# Altium schematic sheet COMMUNICATION.SchDoc
size 420 x 297 mm; SheetNumber: 4; SheetTotal: 6
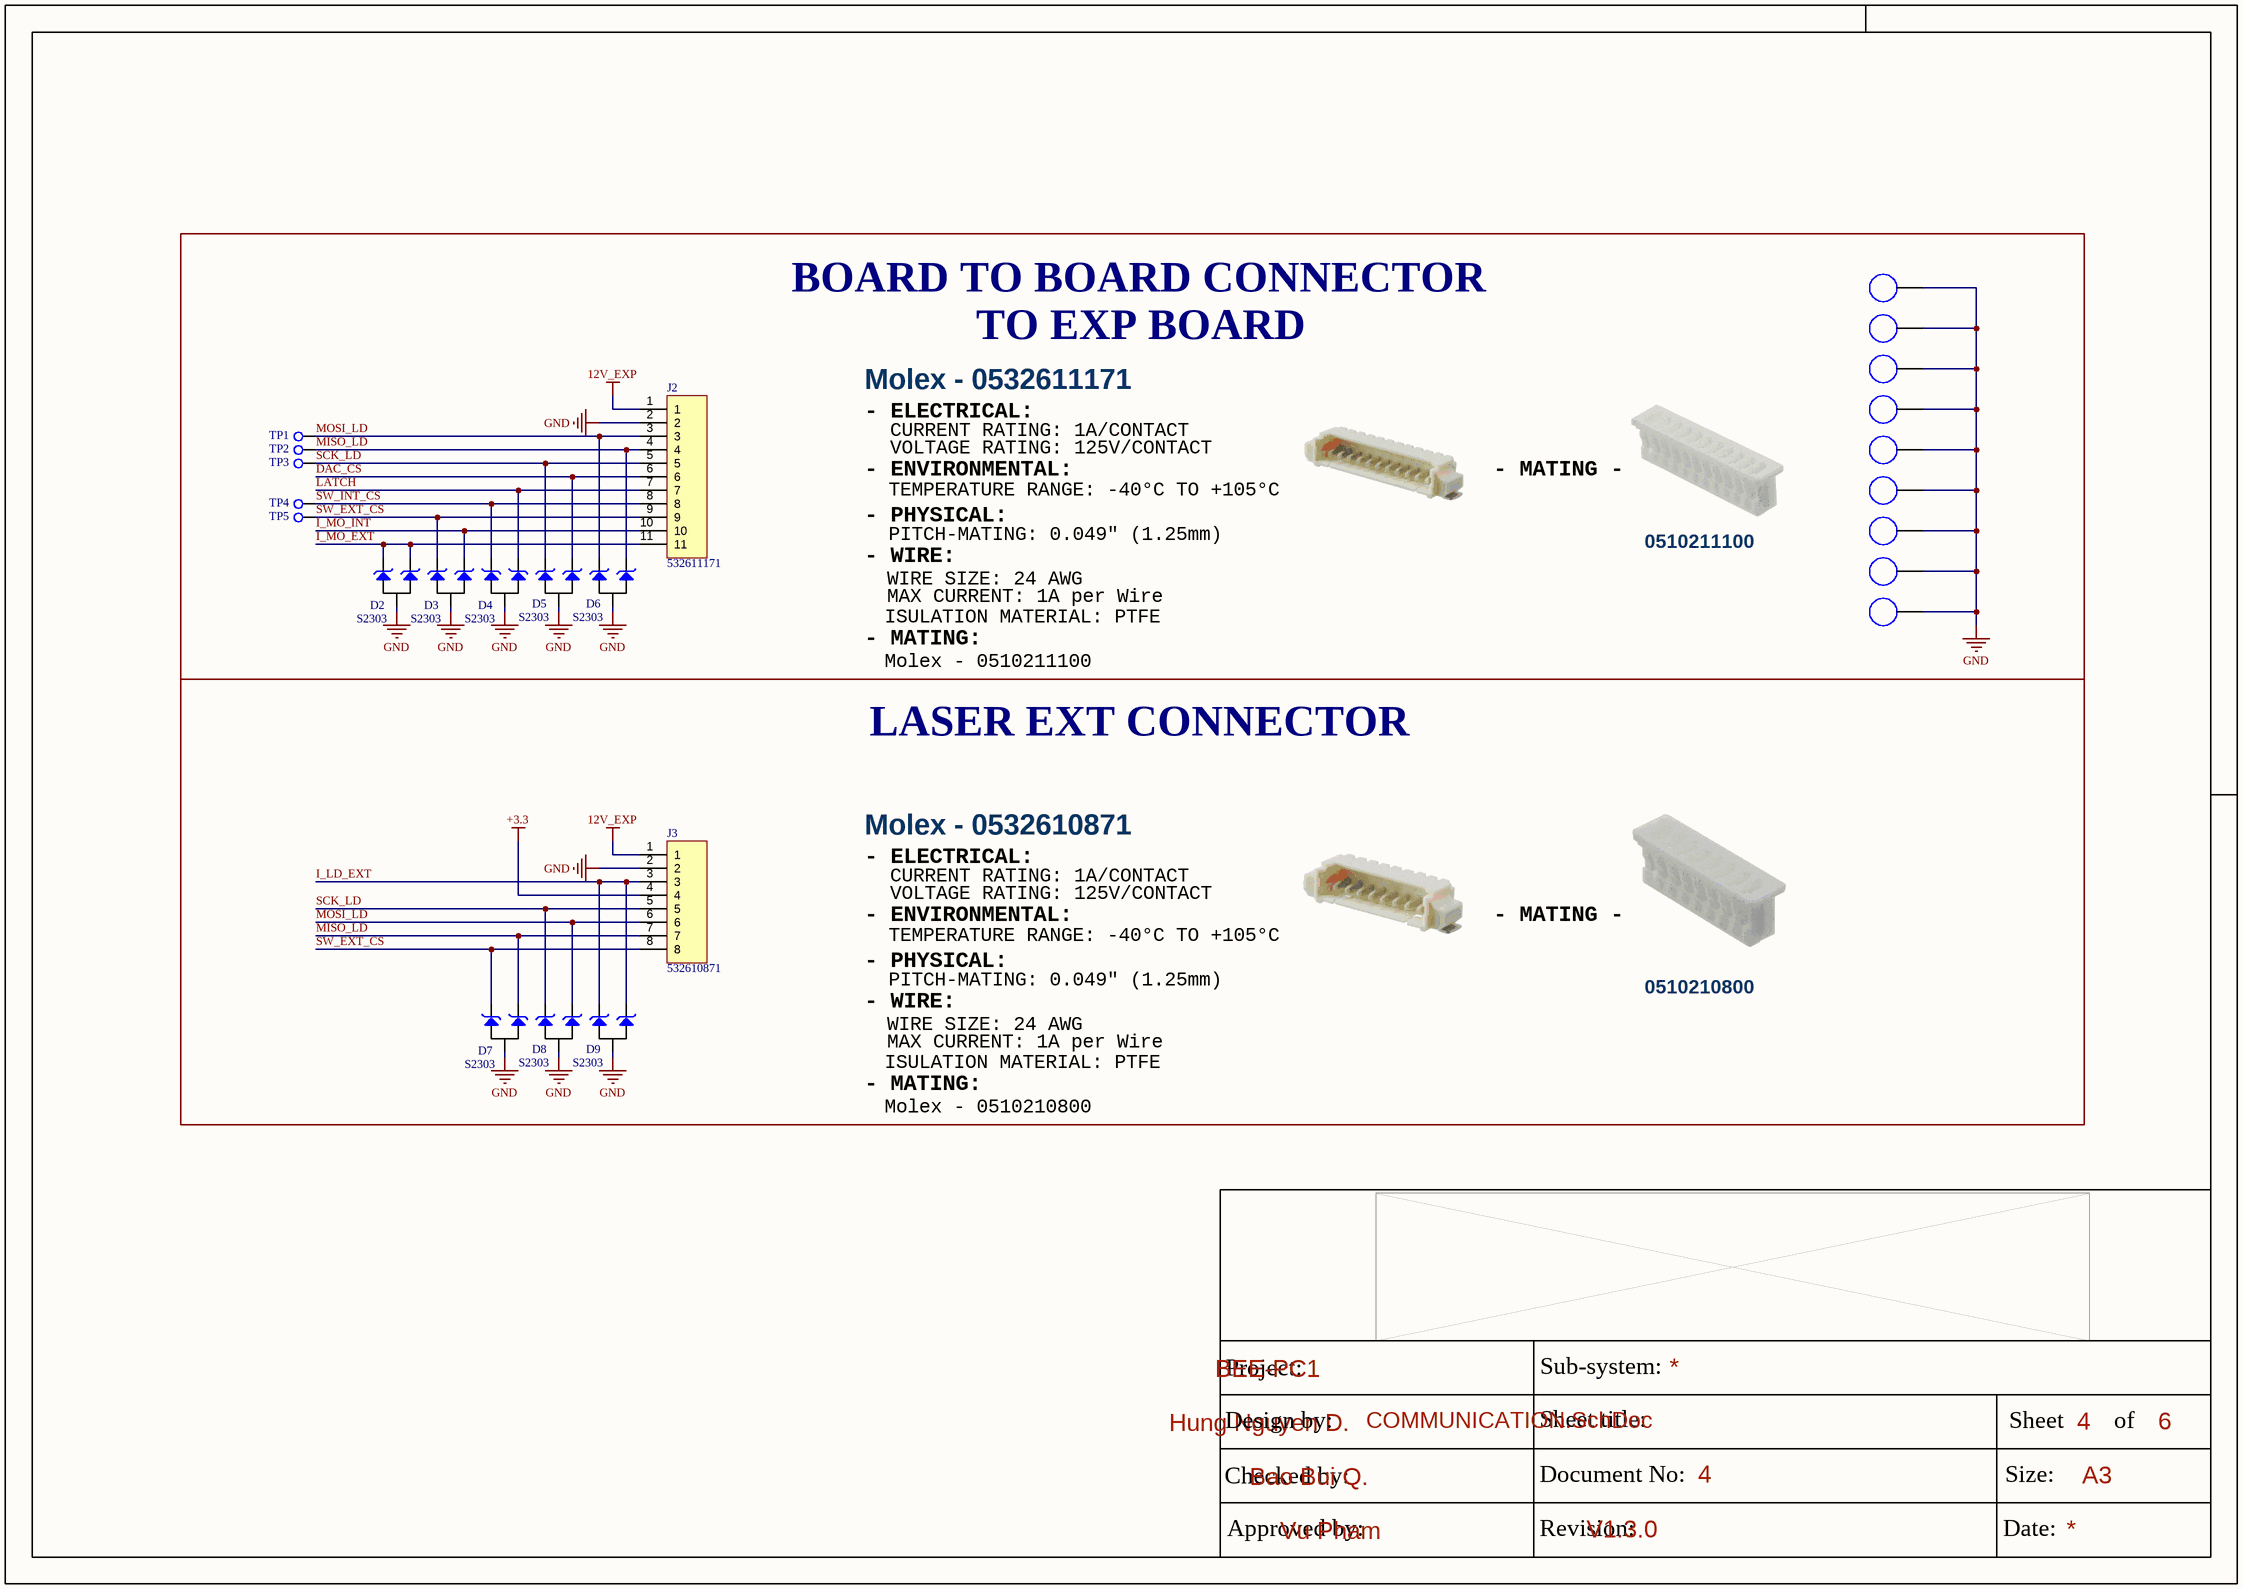
[diagram p0: COMMUNICATION.SchDoc]

## Parts
D2  S2303  [SOT23-123]
D3  S2303  [SOT23-123]
D4  S2303  [SOT23-123]
D5  S2303  [SOT23-123]
D6  S2303  [SOT23-123]
D7  S2303  [SOT23-123]
D8  S2303  [SOT23-123]
D9  S2303  [SOT23-123]
H1  HOLD  [M3]  (value not drawn)
H2  HOLD  [M3]  (value not drawn)
H3  HOLD  [M3]  (value not drawn)
H4  HOLD  [M3]  (value not drawn)
H5  HOLD  [M3]  (value not drawn)
H6  HOLD  [M3]  (value not drawn)
H7  HOLD  [M3]  (value not drawn)
H8  HOLD  [M3]  (value not drawn)
H9  HOLD  [M3]  (value not drawn)
J2  532611171  [MOLEX_532611171]
J3  532610871  [MOLEX_532610001]
TP1  Test_Point  [TESTPOINT]  (value not drawn)
TP2  Test_Point  [TESTPOINT]  (value not drawn)
TP3  Test_Point  [TESTPOINT]  (value not drawn)
TP4  Test_Point  [TESTPOINT]  (value not drawn)
TP5  Test_Point  [TESTPOINT]  (value not drawn)

## Blocks framed on the sheet
LASER EXT CONNECTOR: D7-D9 J3

## Nets
12V_EXP: J2.1 J3.1
+3.3: J3.4
GND: D2.2 D3.2 D4.2 D5.2 D6.2 D7.2 D8.2 D9.2 H1.1 H2.1 H3.1 H4.1 H5.1 H6.1 H7.1 H8.1 H9.1 J2.2 J3.2
DAC_CS: D5.3 J2.6
I_LD_EXT: D9.1 D9.3 J3.3
I_MO_EXT: D2.1 D2.3 J2.11
I_MO_INT: D3.3 J2.10
LATCH: D4.1 J2.7
MISO_LD: D6.3 D7.1 J2.4 J3.7 TP2.1
MOSI_LD: D6.1 D8.3 J2.3 J3.6 TP1.1
SCK_LD: D5.1 D8.1 J2.5 J3.5 TP3.1
SW_EXT_CS: D3.1 D7.3 J2.9 J3.8 TP5.1
SW_INT_CS: D4.3 J2.8 TP4.1

## Notes on the sheet
- BOARD TO BOARD CONNECTOR
- Molex - 0532611171
- TO EXP BOARD
- - ELECTRICAL:
- CURRENT RATING: 1A/CONTACT
- VOLTAGE RATING: 125V/CONTACT
- - ENVIRONMENTAL:
- - PHYSICAL:
- TEMPERATURE RANGE: -40°C TO +105°C
- - MATING -
- - WIRE:
- WIRE SIZE: 24 AWG
- PITCH-MATING: 0.049" (1.25mm)
- 0510211100
- - MATING:
- ISULATION MATERIAL: PTFE
- Molex - 0510211100
- MAX CURRENT: 1A per Wire
- Molex - 0532610871
- 0510210800
- Molex - 0510210800
- Project:
- BEE-PC1
- Sub-system:
- Design by:
- Hung Nguyen D.
- Bao Bui Q.
- Sheet title:
- Sheet
- A3
- of
- Checked by:
- Approved by:
- Vu Pham
- Revision:
- Document No:
- V1.3.0
- Size:
- Date:

## Library data of the parts
H1-H9 = PAD_HOLD
J2 = 532611171: Manufacturer_Name: Molex Connector Corporation; Copyright: Copyright (C) 2025 Ultra Librarian. All rights reserved.; Manufacturer_Part_Number: 532611171; Datasheet: https://www.molex.com/en-us/products/part-detail-pdf/532611171?display=pdf; RefDes: RefDes; Type: Type
J3 = 532610871: Manufacturer_Name: Molex Connector Corporation; Copyright: Copyright (C) 2025 Ultra Librarian. All rights reserved.; Manufacturer_Part_Number: 532610871; Datasheet: https://www.molex.com/en-us/products/part-detail-pdf/532610871?display=pdf; RefDes: RefDes; Type: Type